# Altium schematic sheet KRAC_pz.SchDoc: sdfdf
size 410 x 297 mm; ApprovedBy: Утвердил; CheckedBy: Проверил; Author: Разработал; SheetNumber: Лист; SheetTotal: Листов; PageSetup: Record=PageOptions|CenterHorizontal=True|CenterVertical=True|PrintScale=1.00|XCorrection=1.00|YCorrection=1.00|PrintKind=1|BorderSize=5000000|LeftOffset=0|BottomOffset=0|Orientation=2|PaperLength=1000|PaperWidth=1000|Scale=100|PaperSource=15|PrintQuality=1200|MediaType=1|DitherType=10|PaperKind=A3|PrintScaleMode=1; Weight: -; ScaleFactor: -; NormInspection: Норм.Контр.
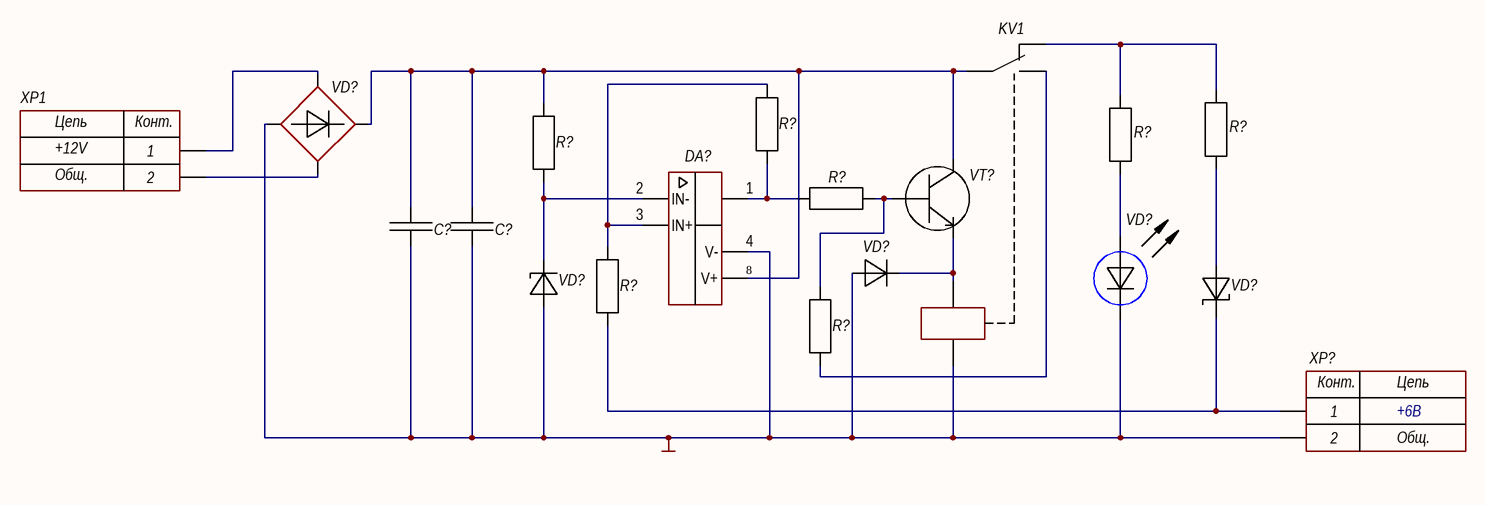
[diagram p0: KRAC_pz.SchDoc]

## Parts
(Parts that share a designator on the sheet are numbered #1, #2 ... from top to bottom, then left to right.)
*?#1  KV1
*?#2  XP1
*?#3  COMPONENT_1  (value not drawn)
C?#1  (no value)  [CAP: ECHU(X) D (2416)]
C?#2  (no value)  [CAP: ECHU(X) D (2416)]
DA?  (no value)  [SOT23-5]
R?#1  *  [R1206]  (value not drawn)
R?#2  *  [R1206]  (value not drawn)
R?#3  *  [R1206]  (value not drawn)
R?#4  *  [R1206]  (value not drawn)
R?#5  *  [R1206]  (value not drawn)
R?#6  *  [R1206]  (value not drawn)
R?#7  *  [R1206]  (value not drawn)
VD?#1  (no value)  [DIODE: DF206S-G]
VD?#2  (no value)  [LED: 0402B]
VD?#3  (no value)  [DIODE: SMA]
VD?#4  (no value)  [DIODE: SMA]
VD?#5  (no value)  [DIODE: SMA]
VT?  (no value)  [DPAK]
XP?  (no value)  [CON: 6PCV-02-006]

## Nets
GND: *?#3.1 C?#1.2 C?#2.2 DA?.4(V-) VD?#1.1 VD?#2.2(C) VD?#3.1(A) VD?#5.1 XP?.2
Net*?#1_3: *?#1.3 C?#1.1 C?#2.1 DA?.8(V+) R?#4.2 VD?#1.3 VT?.1(B)
Net*?#1_4: *?#1.4 R?#2.2 R?#3.2
Net*?#1_5: *?#1.5 R?#7.1
Net*?#2_1: *?#2.1 VD?#1.2
Net*?#2_2: *?#2.2 VD?#1.4
Net*?#3_2: *?#3.2 VD?#5.2 VT?.3(E)
NetDA?_1: DA?.1(OUT) R?#1.1 R?#5.1
NetDA?_2: DA?.2(IN-) R?#4.1 VD?#3.2(C)
NetDA?_3: DA?.3(IN+) R?#1.2 R?#6.2
NetR?#2_1: R?#2.1 VD?#4.1
NetR?#3_1: R?#3.1 VD?#2.1(A)
NetR?#5_2: R?#5.2 R?#7.2 VT?.2(C)
NetR?#6_1: R?#6.1 VD?#4.2 XP?.1

Not connected (* = marked no-connect by the designer): DA? 5 6 7

## Notes on the sheet
- +12V
- +6В
- Перв. примен.
- Справ. №
- ПЗ:                             Дата
- Подп. и дата
- Инв. № дубл.
- Взам. инв. №
- Разраб.
- Изм.
- Лист
- № докум.
- Подп.
- Дата
- Литера
- Масса
- Масштаб
- Пров.
- Т.контр.
- Листов
- Инв. № подл.
- Н.контр.
- Утв.
- Форма 1 ГОСТ 2.104-2006
- Копировал
- Формат А3
- (in symbol Connector_6PCV-02) Конт.; Цепь; Общ.
- (in symbol MY_connector) Цепь; Конт.; Общ.

## Library data of the parts
*?#1 = my2
*?#2 = MY_connector
*?#3 = my1
C?#1 C?#2 = Film_SMD: Manufacturer: Panasonic Electronic Components; PartNumber: ECH-U1H104JX9; ValueManufacturerPartNumber: Film capacitor, 0.1µF, 50VDC, ±5%, *, 1913, -55...+125°C; TypeCapacitor: Film capacitor; Tolerance: ±5%; Voltage: 50VDC; Value: 0.1µF; Package: 1913; HelpURL: https://www.digikey.com/product-detail/en/panasonic-electronic-components/ECH-U1H104JX9/PCF1561CT-ND/1630924; Temperature: -55...+125°C; Impedance: *
DA? = LM358: OP amplifier; Manufacturer: Texas Instruments; ValueManufacturerPartNumber: IC op amplifier, Rail-to-Rail, 1 MHz, 2.7...5.5V, -40...+125°C, SOT23-5; PartNumber: LMV321IDBVR; Supply: 2.7...5.5V; OutputType: Rail-to-Rail; GainBandwidth: 1 MHz; HelpURL: https://www.digikey.com/product-detail/en/texas-instruments/LMV321IDBVR/296-9567-1-ND/379849; Package: SOT23-5; ComponentType: IC op amplifier; Temperature: -40...+125°C
R?#1-R?#7 = MyResistor: Model: *; Manufacture: *; Case: *; Help URL: *; Value: *
VD?#1 = 1PH rectifier: Manufacturer: Comchip Technology; ValueManufacturerPartNumber: Single phase rectifier, 600V, 2A, 1.1V, 4-SMD, -55...+150°C; PartNumber: DF206ST-G; TypeDiode: Single phase rectifier; Voltage: 600V; Current: 2A; VoltageDrop: 1.1V; Package: 4-SMD; HelpURL: https://www.digikey.com/product-detail/en/comchip-technology/DF206ST-G/641-1425-1-ND/2208797; Temperature: -55...+150°C
VD?#2 = LED_single: ValueManufacturerPartNumber: LED, Green, *, *, *, -55...+150°C; TypeDiode: LED; ColorParameter: Green; Manufacturer: *; Package: *; HelpURL: *; Temperature: -55...+150°C; Current: *; VoltageDrop: *; PartNumber: *; Color: GREEN
VD?#3 = Zener_single: Manufacturer: Diodes Incorporated; ValueManufacturerPartNumber: Zener diode, 5.1V, 500mW, 0.9V, 17Ohm, SOD-123, -55...+150°C; PartNumber: MMSZ5231B-7-F; TypeDiode: Zener diode; Current: 500mW; VoltageDrop: 0.9V; RecoveryTime: 17Ohm; Voltage: 5.1V; Package: SOD-123; HelpURL: https://www.digikey.com/product-detail/en/diodes-incorporated/MMSZ5231B-7-F/MMSZ5231B-FDICT-ND/755506; Temperature: -55...+150°C
VD?#4 = Schottky_single: Manufacturer: Diodes Incorporated; ValueManufacturerPartNumber: Schottky diode, 80V, 500mA, 1V, 15pF, SOD-123, -55...+150°C; PartNumber: MBR0580S1-7; TypeDiode: Schottky diode; Voltage: 80V; Current: 500mA; VoltageDrop: 1V; RecoveryTime: 15pF; Package: SOD-123; HelpURL: https://www.digikey.com/product-detail/en/diodes-incorporated/MBR0580S1-7/MBR0580S1-7DICT-ND/5080371; Temperature: -55...+150°C
VD?#5 = Diode_single: Manufacturer: Micro Commercial; ValueManufacturerPartNumber: Single diode, 75V, 150mA, 1V, 4ns, SOD-323, -55...+150°C; PartNumber: 1N4148WX-TP; TypeDiode: Single diode; Voltage: 75V; Current: 150mA; VoltageDrop: 1V; RecoveryTime: 4ns; Package: SOD-323; HelpURL: https://www.digikey.com/product-detail/en/micro-commercial-co/1N4148WX-TP/1N4148WXTPMSCT-ND/717312; Temperature: -55...+150°C
VT? = BJT_NPN_123: Manufacturer: ON Semiconductor; ValueManufacturerPartNumber: NPN transistor, 45V, 100mA, 100MHz, 300mW, 0.6V, 420, SOT-23, -55...+125°C; PartNumber: BC847CLT1G; TypeTransistor: NPN transistor; VoltageCE: 45V; CurrentCE: 100mA; VoltageSaturation: 0.6V; Frequency: 100MHz; CurrentGain: 420; MaxPower: 300mW; Package: SOT-23; HelpURL: https://www.digikey.com/product-detail/en/on-semiconductor/BC847CLT1G/BC847CLT1GOSCT-ND/917836; Temperature: -55...+125°C
XP? = Connector_6PCV-02: Manufacturer: TE Connectivity; ValueManufacturerPartNumber: Connector, 2pin, 9.53mm, 300VAC, 25A; PartNumber: 6PCV-02-006; VoltageMax: 300VAC; Pitch: 9.53mm; CurrentMax: 25A; Multichannel: 2pin; HelpURL: https://www.digikey.com/products/en?keywords=6PCV-02-006; TypeConnector: Connector